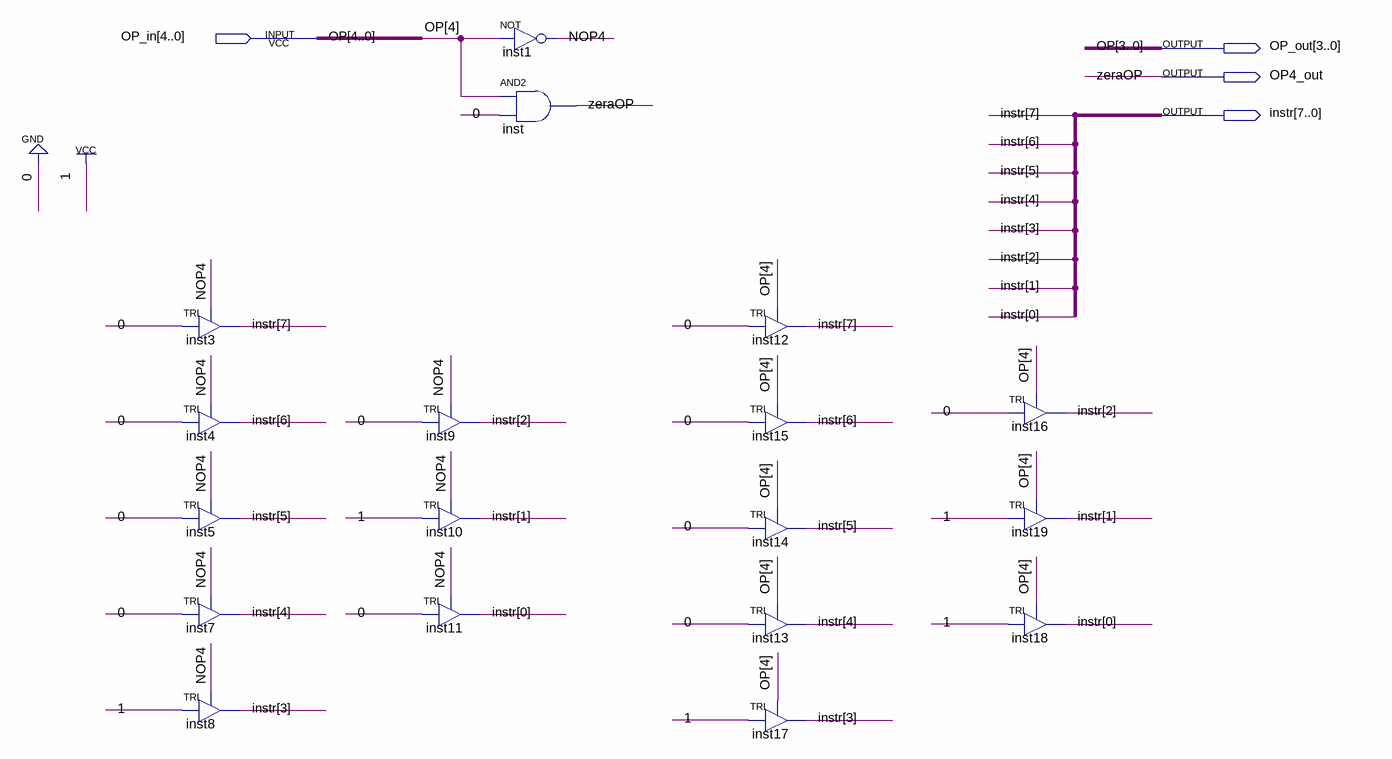
[diagram p0: schematic sheet]
// Quartus schematic ajusteOperando(1).bdf as structural Verilog: 18 symbols, 4 pins
module \ajusteOperando(1)  (
  input  [4:0] OP_in,
  output [3:0] OP_out,
  output OP4_out,
  output [7:0] instr
);

  wire NOP4;

  TRI inst3 (.IN(1'b0), .OE(NOP4), .OUT(instr[7]));
  TRI inst4 (.IN(1'b0), .OE(NOP4), .OUT(instr[6]));
  TRI inst5 (.IN(1'b0), .OE(NOP4), .OUT(instr[5]));
  TRI inst7 (.IN(1'b0), .OE(NOP4), .OUT(instr[4]));
  TRI inst8 (.IN(1'b1), .OE(NOP4), .OUT(instr[3]));
  TRI inst9 (.IN(1'b0), .OE(NOP4), .OUT(instr[2]));
  TRI inst10 (.IN(1'b1), .OE(NOP4), .OUT(instr[1]));
  TRI inst11 (.IN(1'b0), .OE(NOP4), .OUT(instr[0]));
  not inst1 (NOP4, OP_in[4]);
  and inst (OP4_out, OP_in[4], 1'b0);
  TRI inst12 (.IN(1'b0), .OE(OP_in[4]), .OUT(instr[7]));
  TRI inst15 (.IN(1'b0), .OE(OP_in[4]), .OUT(instr[6]));
  TRI inst14 (.IN(1'b0), .OE(OP_in[4]), .OUT(instr[5]));
  TRI inst13 (.IN(1'b0), .OE(OP_in[4]), .OUT(instr[4]));
  TRI inst17 (.IN(1'b1), .OE(OP_in[4]), .OUT(instr[3]));
  TRI inst16 (.IN(1'b0), .OE(OP_in[4]), .OUT(instr[2]));
  TRI inst19 (.IN(1'b1), .OE(OP_in[4]), .OUT(instr[1]));
  TRI inst18 (.IN(1'b1), .OE(OP_in[4]), .OUT(instr[0]));

  assign OP_out = OP_in[3:0];

  // Other names for the same wires on the sheet: OP[4:0] = OP_in; zeraOP = OP4_out
endmodule
